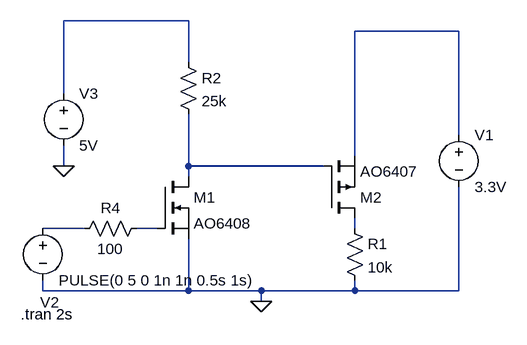
[diagram p0: schematic Draft1.asc]
Draft1.asc, the LTspice schematic file:
Version 4
SHEET 1 880 680
WIRE 176 -144 -16 -144
WIRE 592 -128 432 -128
WIRE 176 -80 176 -144
WIRE -16 -32 -16 -144
WIRE 592 32 592 -128
WIRE 432 64 432 -128
WIRE -16 80 -16 48
WIRE 176 80 176 0
WIRE 384 80 176 80
WIRE 176 96 176 80
WIRE 16 176 -48 176
WIRE 128 176 96 176
WIRE 432 176 432 160
WIRE -48 272 -48 256
WIRE 176 272 176 192
WIRE 176 272 -48 272
WIRE 288 272 176 272
WIRE 432 272 432 256
WIRE 432 272 288 272
WIRE 592 272 592 112
WIRE 592 272 432 272
WIRE 288 288 288 272
FLAG -16 80 0
FLAG 288 288 0
SYMBOL nmos 128 96 R0
SYMATTR InstName M1
SYMATTR Value AO6408
SYMBOL pmos 384 160 M180
SYMATTR InstName M2
SYMATTR Value AO6407
SYMBOL voltage 592 16 R0
WINDOW 123 0 0 Left 0
WINDOW 39 0 0 Left 0
SYMATTR InstName V1
SYMATTR Value 3.3V
SYMBOL res 160 -96 R0
SYMATTR InstName R2
SYMATTR Value 25k
SYMBOL res 112 160 R90
WINDOW 0 0 56 VBottom 2
WINDOW 3 32 56 VTop 2
SYMATTR InstName R4
SYMATTR Value 100
SYMBOL voltage -48 160 R0
WINDOW 0 -4 130 Left 2
WINDOW 123 0 0 Left 0
WINDOW 39 0 0 Left 0
SYMATTR InstName V2
SYMATTR Value PULSE(0 5 0 1n 1n 0.5s 1s)
SYMBOL voltage -16 -48 R0
WINDOW 123 0 0 Left 0
WINDOW 39 0 0 Left 0
SYMATTR InstName V3
SYMATTR Value 5V
SYMBOL res 416 160 R0
SYMATTR InstName R1
SYMATTR Value 10k
TEXT -82 308 Left 2 !.tran 2s

The netlist it stands for:
* Draft1.asc
M1 N003 N005 0 0 AO6408
M2 N006 N003 N002 N002 AO6407
V1 N002 0 3.3V
R2 N001 N003 25k
R4 N005 N004 100
V2 N004 0 PULSE(0 5 0 1n 1n 0.5s 1s)
V3 N001 0 5V
R1 N006 0 10k
.model NMOS NMOS
.model PMOS PMOS
.lib standard.mos
.tran 2s
.backanno
.end